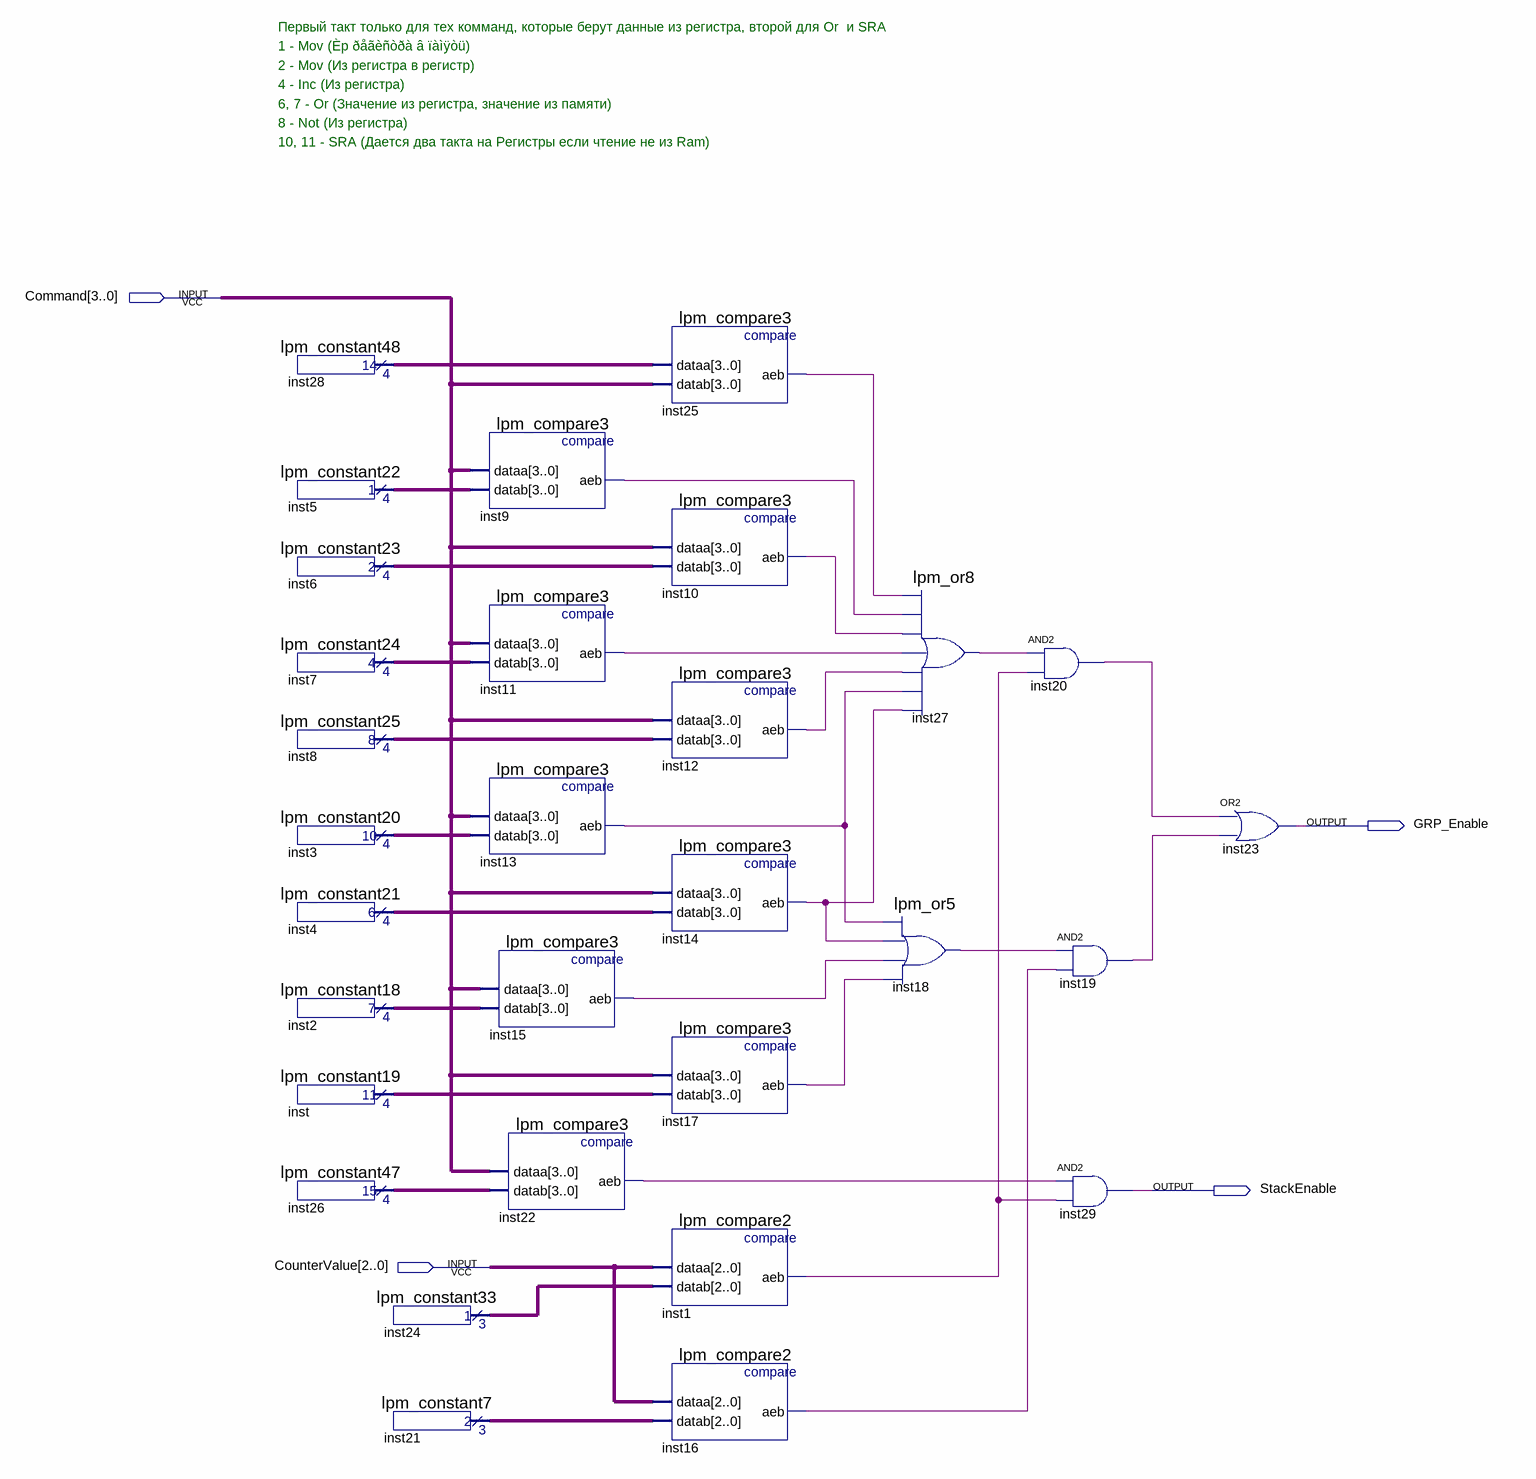
[diagram p0: schematic sheet]
// Quartus schematic GPRReadEnable.bdf as structural Verilog: 30 symbols, 4 pins
module GPRReadEnable (
  input  [3:0] Command,
  input  [2:0] CounterValue,
  output GRP_Enable,
  output StackEnable
);

  wire inst1_aeb, inst9_aeb, inst10_aeb, inst11_aeb, inst12_aeb, inst13_aeb, inst14_aeb, inst15_aeb,
       inst16_aeb, inst17_aeb, inst18_result, inst19_out, inst20_out, inst22_aeb, inst25_aeb, inst27_result;
  wire [2:0] inst21_result, inst24_result;
  wire [3:0] inst2_result, inst3_result, inst4_result, inst5_result, inst6_result, inst7_result,
       inst8_result, inst26_result, inst28_result, inst_result;

  lpm_constant48 inst28 (.result(inst28_result));
  lpm_constant22 inst5 (.result(inst5_result));
  lpm_constant23 inst6 (.result(inst6_result));
  lpm_constant24 inst7 (.result(inst7_result));
  lpm_constant25 inst8 (.result(inst8_result));
  lpm_constant20 inst3 (.result(inst3_result));
  lpm_constant21 inst4 (.result(inst4_result));
  lpm_constant18 inst2 (.result(inst2_result));
  lpm_constant19 inst (.result(inst_result));
  lpm_constant47 inst26 (.result(inst26_result));
  lpm_constant33 inst24 (.result(inst24_result));
  lpm_constant7 inst21 (.result(inst21_result));
  lpm_compare3 inst9 (.dataa(Command), .datab(inst5_result), .aeb(inst9_aeb));
  lpm_compare3 inst11 (.dataa(Command), .datab(inst7_result), .aeb(inst11_aeb));
  lpm_compare3 inst13 (.dataa(Command), .datab(inst3_result), .aeb(inst13_aeb));
  lpm_compare3 inst15 (.dataa(Command), .datab(inst2_result), .aeb(inst15_aeb));
  lpm_compare3 inst22 (.dataa(Command), .datab(inst26_result), .aeb(inst22_aeb));
  lpm_compare3 inst25 (.dataa(inst28_result), .datab(Command), .aeb(inst25_aeb));
  lpm_compare3 inst10 (.dataa(Command), .datab(inst6_result), .aeb(inst10_aeb));
  lpm_compare3 inst12 (.dataa(Command), .datab(inst8_result), .aeb(inst12_aeb));
  lpm_compare3 inst14 (.dataa(Command), .datab(inst4_result), .aeb(inst14_aeb));
  lpm_compare3 inst17 (.dataa(Command), .datab(inst_result), .aeb(inst17_aeb));
  lpm_compare2 inst1 (.dataa(CounterValue), .datab(inst24_result), .aeb(inst1_aeb));
  lpm_compare2 inst16 (.dataa(CounterValue), .datab(inst21_result), .aeb(inst16_aeb));
  lpm_or8 inst27 (
    .data0(inst25_aeb), .data1(inst9_aeb), .data2(inst10_aeb), .data3(inst11_aeb), .data4(inst12_aeb),
    .data5(inst13_aeb), .data6(inst14_aeb), .result(inst27_result));
  lpm_or5 inst18 (
    .data0(inst13_aeb), .data1(inst14_aeb), .data2(inst15_aeb), .data3(inst17_aeb), .result(inst18_result));
  and inst20 (inst20_out, inst27_result, inst1_aeb);
  and inst19 (inst19_out, inst18_result, inst16_aeb);
  and inst29 (StackEnable, inst22_aeb, inst1_aeb);
  or inst23 (GRP_Enable, inst20_out, inst19_out);

  // Notes on the sheet:
  //   Первый такт только для тех комманд, которые берут данные из регистра, второй для Or  и SRA
  //   1 - Mov (Èp ðåãèñòðà â ïàìÿòü)
  //   2 - Mov (Из регистра в регистр)
  //   4 - Inc (Из регистра)
  //   6, 7 - Or (Значение из регистра, значение из памяти)
  //   8 - Not (Из регистра)
  //   10, 11 - SRA (Дается два такта на Регистры если чтение не из Ram)
endmodule
